# EAGLE schematic generation-7-electronics (EAGLE 6.1)
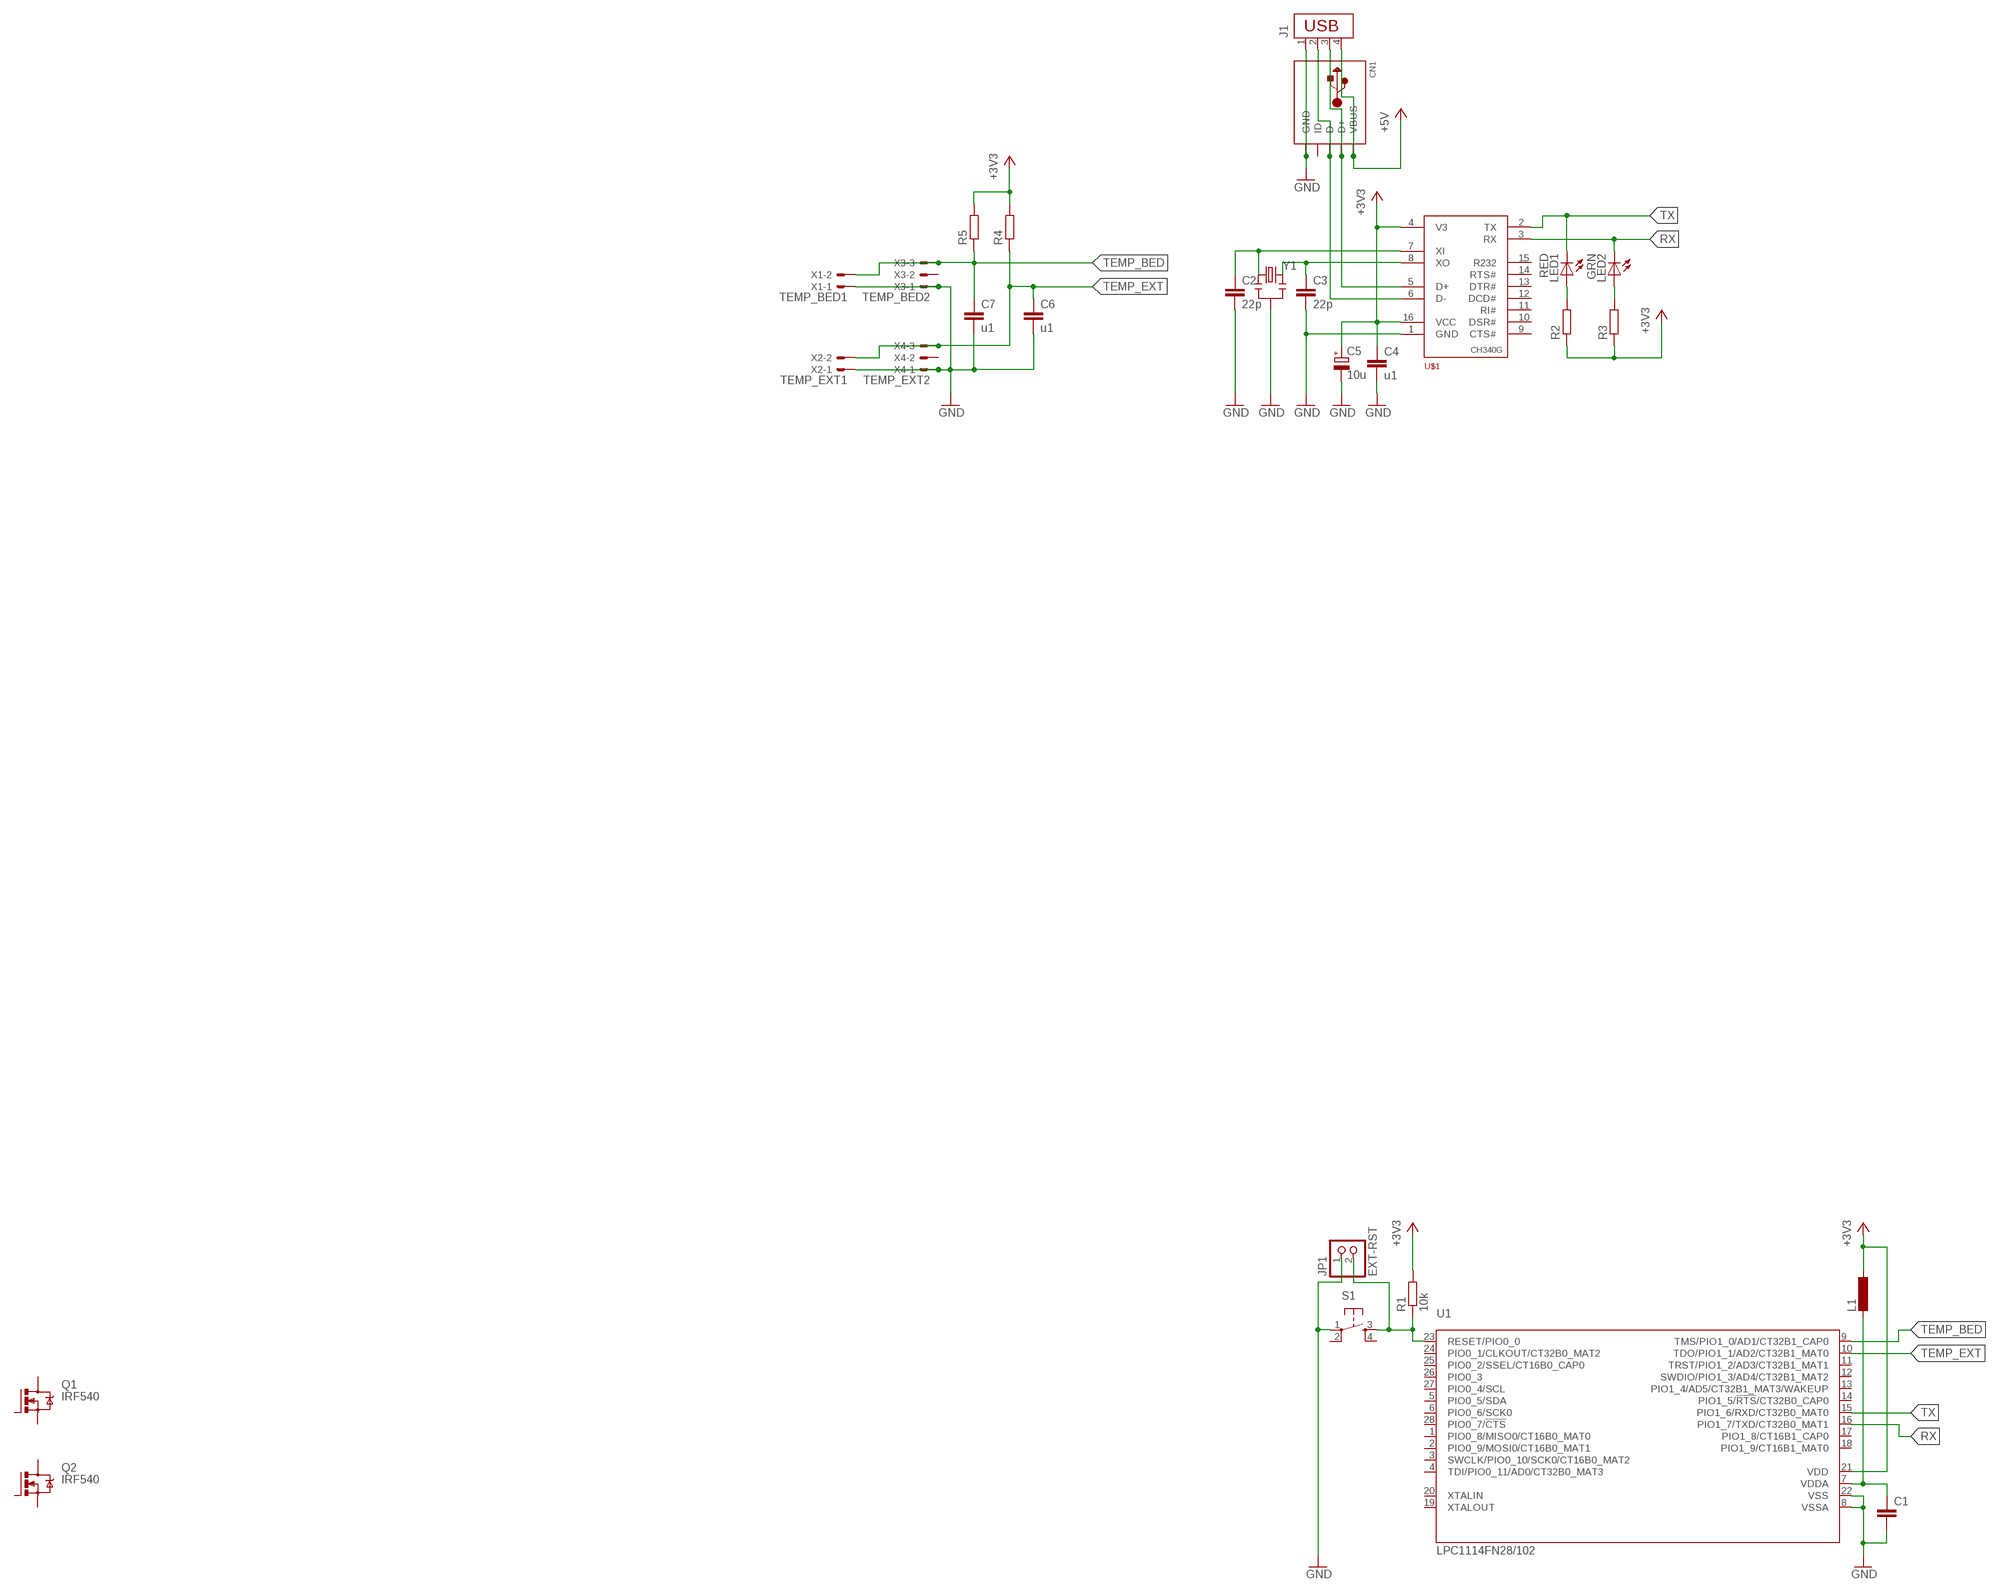
[diagram p0: schematic, sheet 1]

## Parts
C1  C-EU025-025X050  [C025-025X050]
C2  22p  C-EU025-025X050  [C025-025X050]
C3  22p  C-EU025-025X050  [C025-025X050]
C4  u1  C-EU025-025X050  [C025-025X050]
C5  10u  CPOL-EUE2.5-6  [E2,5-6]
C6  u1  C-EU025-025X050  [C025-025X050]
C7  u1  C-EU025-025X050  [C025-025X050]
CN1  USBTHM  [USB-MINIB-THM]
J1  CON-USB-B  [USB-B]
JP1  EXT-RST  PINHD-1X2  [1X02]
L1  L-EU0207/2V  [0207/2V]
LED1  RED  LED3MM  [LED3MM]
LED2  GRN  LED3MM  [LED3MM]
Q1  IRF540  [TO220BV]
Q2  IRF540  [TO220BV]
R1  10k  R-EU_0204/7  [0204/7]
R2  R-EU_0204/7  [0204/7]
R3  R-EU_0204/7  [0204/7]
R4  R-EU_0204/7  [0204/7]
R5  R-EU_0204/7  [0204/7]
S1  TAC_SWITCHPTH  [TACTILE-PTH]
U1  LPC1114FN28/102  [SOT117]
U$1  CH340G  [SO16]
X1  TEMP_BED1  JST-XH-02-PIN-LONG-PAD  [JST-XH-02-PACKAGE-LONG-PAD]
X2  TEMP_EXT1  JST-XH-02-PIN-LONG-PAD  [JST-XH-02-PACKAGE-LONG-PAD]
X3  TEMP_BED2  JST-XH-03-PIN-LONG-PAD  [JST-XH-03-PACKAGE-LONG-PAD]
X4  TEMP_EXT2  JST-XH-03-PIN-LONG-PAD  [JST-XH-03-PACKAGE-LONG-PAD]
Y1  RESONATORPTH  [RESONATOR-PTH]

## Nets
+3V3: C4.1 C5.+ L1.1 R1.2 R2.1 R3.1 R4.2 R5.2 U1.21(VDD) U$1.4(V3) U$1.16(VCC)
+5V: CN1.VBUS J1.4
GND: C1.2 C2.2 C3.2 C4.2 C5.- C6.2 C7.2 CN1.GND J1.1 JP1.1 S1.1 U1.8(VSSA) U1.22(VSS) U$1.1(GND) X1.1 X2.1 X3.1 X4.1 Y1.2
N$1: C1.1 L1.2 U1.7(VDDA)
N$2: JP1.2 R1.1 S1.3 U1.23(RESET/PIO0_0)
N$3: CN1.D- J1.2 U$1.6(D-)
N$4: LED1.A R2.2
N$5: C2.1 U$1.7(XI) Y1.1
N$6: C3.1 U$1.8(XO) Y1.3
N$7: LED2.A R3.2
N$9: CN1.D+ J1.3 U$1.5(D+)
RX: LED2.K(C) U1.16(PIO1_7/TXD/CT32B0_MAT1) U$1.3(RX)
TEMP_BED: C7.1 R5.1 U1.9(TMS/PIO1_0/AD1/CT32B1_CAP0) X1.2 X3.3
TEMP_EXT: C6.1 R4.1 U1.10(TDO/PIO1_1/AD2/CT32B1_MAT0) X2.2 X4.3
TX: LED1.K(C) U1.15(PIO1_6/RXD/CT32B0_MAT0) U$1.2(TX)
Unconnected: CN1.ID Q1.D Q1.G Q1.S Q2.D Q2.G Q2.S S1.2 S1.4 U1.1(PIO0_8/MISO0/CT16B0_MAT0) U1.2(PIO0_9/MOSI0/CT16B0_MAT1) U1.3(SWCLK/PIO0_10/SCK0/CT16B0_MAT2) U1.4(TDI/PIO0_11/AD0/CT32B0_MAT3) U1.5(PIO0_5/SDA) U1.6(PIO0_6/SCK0) U1.11(TRST/PIO1_2/AD3/CT32B1_MAT1) U1.12(SWDIO/PIO1_3/AD4/CT32B1_MAT2) U1.13(PIO1_4/AD5/CT32B1_MAT3/WAKEUP) U1.14(PIO1_5/!RTS!/CT32B0_CAP0) U1.17(PIO1_8/CT16B1_CAP0) U1.18(PIO1_9/CT16B1_MAT0) U1.19(XTALOUT) U1.20(XTALIN) U1.24(PIO0_1/CLKOUT/CT32B0_MAT2) U1.25(PIO0_2/SSEL/CT16B0_CAP0) U1.26(PIO0_3) U1.27(PIO0_4/SCL) U1.28(PIO0_7/!CTS!) U$1.9(CTS#) U$1.10(DSR#) U$1.11(RI#) U$1.12(DCD#) U$1.13(DTR#) U$1.14(RTS#) U$1.15(R232) X3.2 X4.2

## Library data of the parts
C1-C4 C6 C7 = rcl:C-EU: CAPACITOR, European symbol
C5 = rcl:CPOL-EU: POLARIZED CAPACITOR, European symbol
CN1 = adafruit_t10:USB: USB Connectors USBMINIB - Surface Mount Female Mini-B USB Connector 4UConnector: 06564 By microbuilder.eu Thru-hole RA Female Mini-B USB Connector 4UConnector: 18732 By ladyada.net
J1 = m-pad-2.1:CON-USB-B: USB B type connector
JP1 = pinhead:PINHD-1X2: PIN HEADER
L1 = rcl:L-EU: INDUCTOR, European symbol
LED1 LED2 = led:LED: LED OSRAM: - CHIPLED LG R971, LG N971, LY N971, LG Q971, LY Q971, LO R971, LY R971 LH N974, LH R974 LS Q976, LO Q976, LY Q976 LO Q996 - Hyper CHIPLED LW Q18S LB Q993, LB Q99A, LB R99A - SideLED LS A670, LO A670, LY A670, LG A670, LP A670 LB A673, LV A673, LT A673, LW A673 LH A674 LY A675 LS A676, LA A676, LO A676, LY A676, LW A676 LS A679, LY A679, LG A679 - Hyper Micro SIDELED® LS Y876, LA Y876, LO Y876, LY Y876 LT Y87S - SmartLED LW L88C, LW L88S LB L89C, LB L89S, LG L890 LS L89K, LO L89K, LY L89K LS L896, LA L896, LO L896, LY L896 - TOPLED LS T670, LO T670, LY T670, LG T670, LP T670 LSG T670, LSP T670, LSY T670, LOP T670, LYG T670 LG T671, LOG T671, LSG T671 LB T673, LV T673, LT T673, LW T673 LH T674 LS T676, LA T676, LO T676, LY T676, LB T676, LH T676, LSB T676, LW T676 LB T67C, LV T67C, LT T67C, LS T67K, LO T67K, LY T67K, LW E67C LS E67B, LA E67B, LO E67B, LY E67B, LB E67C, LV E67C, LT E67C LW T67C LS T679, LY T679, LG T679 LS T770, LO T770, LY T770, LG T770, LP T770 LB T773, LV T773, LT T773, LW T773 LH T774 LS E675, LA E675, LY E675, LS T675 LS T776, LA T776, LO T776, LY T776, LB T776 LHGB T686 LT T68C, LB T68C - Hyper Mini TOPLED® LB M676 - Mini TOPLED Santana® LG M470 LS M47K, LO M47K, LY M47K Source: http://www.osram.convergy.de LUXEON: - LUMILED® LXK2-PW12-R00, LXK2-PW12-S00, LXK2-PW14-U00, LXK2-PW14-V00 LXK2-PM12-R00, LXK2-PM12-S00, LXK2-PM14-U00 LXK2-PE12-Q00, LXK2-PE12-R00, LXK2-PE12-S00, LXK2-PE14-T00, LXK2-PE14-U00 LXK2-PB12-K00, LXK2-PB12-L00, LXK2-PB12-M00, LXK2-PB14-N00, LXK2-PB14-P00, LXK2-PB14-Q00 LXK2-PR12-L00, LXK2-PR12-M00, LXK2-PR14-Q00, LXK2-PR14-R00 LXK2-PD12-Q00, LXK2-PD12-R00, LXK2-PD12-S00 LXK2-PH12-R00, LXK2-PH12-S00 LXK2-PL12-P00, LXK2-PL12-Q00, LXK2-PL12-R00 Source: www.luxeon.com KINGBRIGHT: KA-3528ASYC Source: www.kingbright.com
Q1 Q2 = transistor-power:IRF540: HEXFET Power MOSFET
R1-R5 = rcl:R-EU_: RESISTOR, European symbol
S1 = SparkFun-Electromechanical:TAC_SWITCH: Momentary Switch Button commonly used for reset or general input. Spark Fun Electronics SKU : COM-00097 SMT- SWCH-08247
U1 = _MY_OWN_LIB:LPC1114FN28: 32-bit ARM Cortex-M0 microcontroller; up to 64 kB flash and 8 kB SRAM The LPC1110/11/12/13/14/15 are a ARM Cortex-M0 based, low-cost 32-bit MCU family, designed for 8/16-bit microcontroller applications, offering performance, low power, simple instruction set and memory addressing together with reduced code size compared to existing 8/16-bit architectures. The LPC1110/11/12/13/14/15 operate at CPU frequencies of up to 50 MHz. The peripheral complement of the LPC1110/11/12/13/14/15 includes up to 64 kB of flash memory, up to 8 kB of data memory, one Fast-mode Plus I 2 C-bus interface, one RS-485/EIA-485 UART, up to two SPI interfaces with SSP features, four general purpose counter/timers, a 10-bit ADC, and up to 42 general purpose I/O pins. Remark: The LPC111x series consists of the LPC1100 series (parts LPC111x/101/201/301), LPC1100L series (parts LPC111x/002/102/202/302), and the LPC1100XL series (parts LPC111x/103/203/303/323/333). The LPC1100L and LPC1100XL series include the power profiles, a windowed watchdog timer, and a configurable open-drain mode. AAL Eindhoven MK; ADC: 6; FLASH: 32kB; GPIO: 22; PWR_PROFILES: yes; SERIES: LPC1100L; SPI: 1; SRAM: 4kB
U$1 = _MY_OWN_LIB:CH340G
X1 X2 = Rembrandt Electronics - JST XH Connectors v1-0:JST-XH-02-PIN: JST XH Connector 2 Pin Wire to board connector. Pitch: 2,54 mm, (0.100") Number of pins: 2 Created by Rembrandt Electronics www.rembrandtelectronics.com
X3 X4 = Rembrandt Electronics - JST XH Connectors v1-0:JST-XH-03-PIN: JST XH Connector 2 Pin Wire to board connector. Pitch: 2,54 mm, (0.100") Number of pins: 3 Created by Rembrandt Electronics www.rembrandtelectronics.com
Y1 = SparkFun-FreqCtrl:RESONATOR: Resonator Small SMD resonator. Used, eg, on the Arduino Pro/ Pro Mini boards. 8MHz- XTAL-08895 16MHz- XTAL-08900